# EAGLE design esp8266-dev-board (EAGLE 7.3.0)
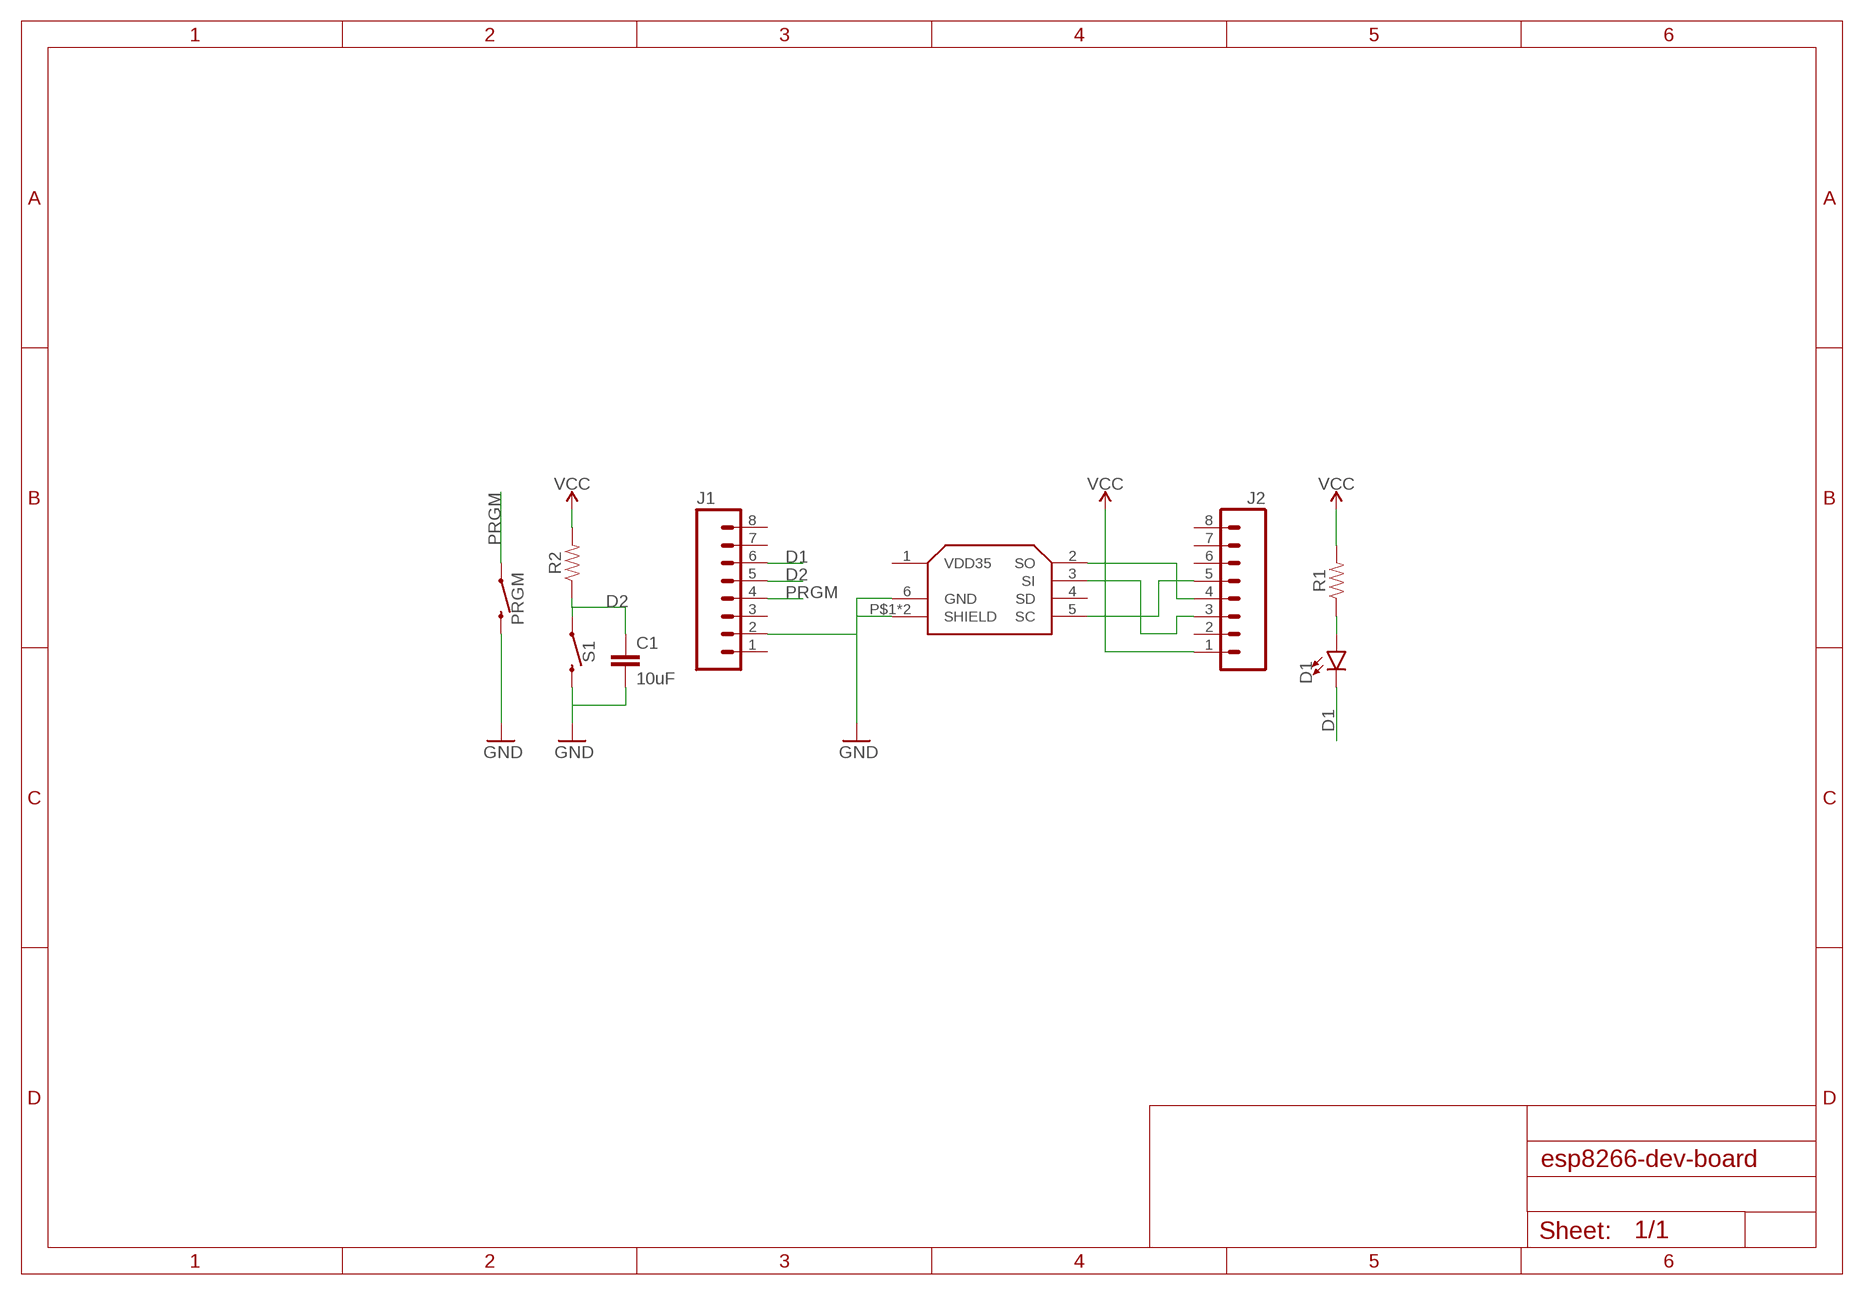
[diagram p0: schematic, sheet 1]

## Parts
C1  10uF  10UF-0805-10V-10%  [0805]
D1  LED0603  [LED-0603]
J1  M08  [1X08_ROUND]
J2  M08  [1X08_ROUND]
PRGM  MOMENTARY-SWITCH-SPST-SMD-6.0X3.5MM  [TACTILE_SWITCH_SMD_6.0X3.5MM]
R1  RESISTOR0805  [0805]
R2  RESISTOR0805  [0805]
S1  MOMENTARY-SWITCH-SPST-SMD-6.0X3.5MM  [TACTILE_SWITCH_SMD_6.0X3.5MM]
U$1  EXT-PORT-AGB  [EXT-PORT-AGB]

## Nets
D1: D1.C J1.6
D2: C1.1 J1.5 R2.1 S1.1
GND [GND]: C1.2 J1.2 PRGM.2 S1.2 U$1.6(GND) U$1.P$1(SHIELD) U$1.P$2(SHIELD)
N$1: J2.5 U$1.5(SC)
N$2: J2.4 U$1.2(SO)
N$3: J2.3 U$1.3(SI)
N$4: D1.A R1.1
PRGM: J1.4 PRGM.1
VCC: J2.1 R1.2 R2.2
Unconnected: J1.1 J1.3 J1.7 J1.8 J2.2 J2.6 J2.7 J2.8 U$1.1(VDD35) U$1.4(SD)

## Library data of the parts
C1 = SparkFun-Capacitors:10UF: 10.0µF ceramic capacitors A capacitor is a passive two-terminal electrical component used to store electrical energy temporarily in an electric field.; PROD_ID: CAP-11330
D1 = SparkFun-LED:LED: LED (Generic) Standard schematic elements and footprints for 5mm, 3mm, 1206, and 0603 sized LEDs. Generic LEDs with no color specified.
J1 J2 = SparkFun-Connectors:M08: Header 8 Standard 8-pin 0.1" header. Use with straight break away headers (SKU : PRT-00116), right angle break away headers (PRT-00553), swiss pins (PRT-00743), machine pins (PRT-00117), and female headers (PRT-00115).; PROD_ID: CONN-08437
PRGM S1 = SparkFun-Switches:MOMENTARY-SWITCH-SPST: Momentary Switch (Pushbutton) - SPST Normally-open (NO) SPST momentary switches (buttons, pushbuttons). Variants PTH-12MM - 12mm square, through-hole Momentary Pushbutton Switch - 12mm Square <https://www.sparkfun.com/products/9190> (COM-09190) PTH-6.0MM, PTH-6.0MM-KIT - 6.0mm square, through-hole Mini Pushbutton Switch <https://www.sparkfun.com/products/97> (COM-00097) KIT package intended for soldering kit's - only one side of pads' copper is exposed. PTH-RIGHT-ANGLE-KIT - Right-angle, through-hole Right Angle Tactile Button <https://www.sparkfun.com/products/10791> - Used on SparkFun BigTime Watch Kit <https://www.sparkfun.com/products/11734> SMD-12MM - 12mm square, surface-mount Tactile Button - SMD (12mm) <https://www.sparkfun.com/products/12993> (COM-12993) Used on SparkFun PicoBoard <https://www.sparkfun.com/products/11888> SMD-4.5MM - 4.5mm Square Trackball Switch Used on SparkFun Blackberry Trackballer Breakout <https://www.sparkfun.com/products/13169> SMD-4.6MMX2.8MM - 4.60mm x 2.80mm, surface mount Used on SparkFun SAMD21 Mini Breakout <https://www.sparkfun.com/products/13664> SMD-5.2MM, SMD-5.2-REDUNDANT - 5.2mm square, surface-mount Mini Pushbutton Switch - SMD <https://www.sparkfun.com/products/8720> (COM-08720) Used on Arduino Pro Mini <https://www.sparkfun.com/products/11114> REDUNDANT package connects both switch circuits together SMD-6.0X3.5MM - 6.0 x 3.5mm, surface mount Momentary Reset Switch SMD <https://www.sparkfun.com/products/8229> (COM-08229) SMD-6.2MM-TALL - 6.2mm square, surface mount Tactile Button - SMD (6mm) <https://www.sparkfun.com/products/12992> Used on SparkFun Digital Sandbox <https://www.sparkfun.com/products/12651> SMD-RIGHT-ANGLE - Right-angle, surface mount Used on SparkFun Block for Intel® Edison - Arduino <https://www.sparkfun.com/products/13036>; PROD_ID: SWCH-00815; SF_SKU: COM-08229
R1 R2 = SparkFun-Resistors:RESISTOR: Generic Resistor Package
U$1 = arcadetv:EXT-PORT-AGB

## Net classes
1 GND: clearance 0.254 mm

## Board
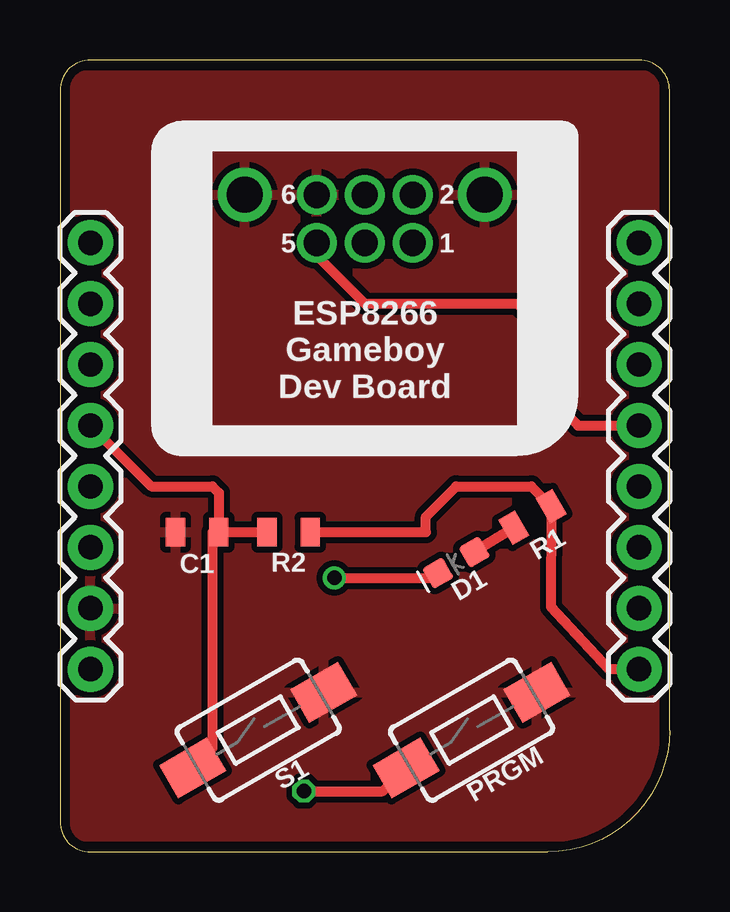
[diagram p1: board, top side]
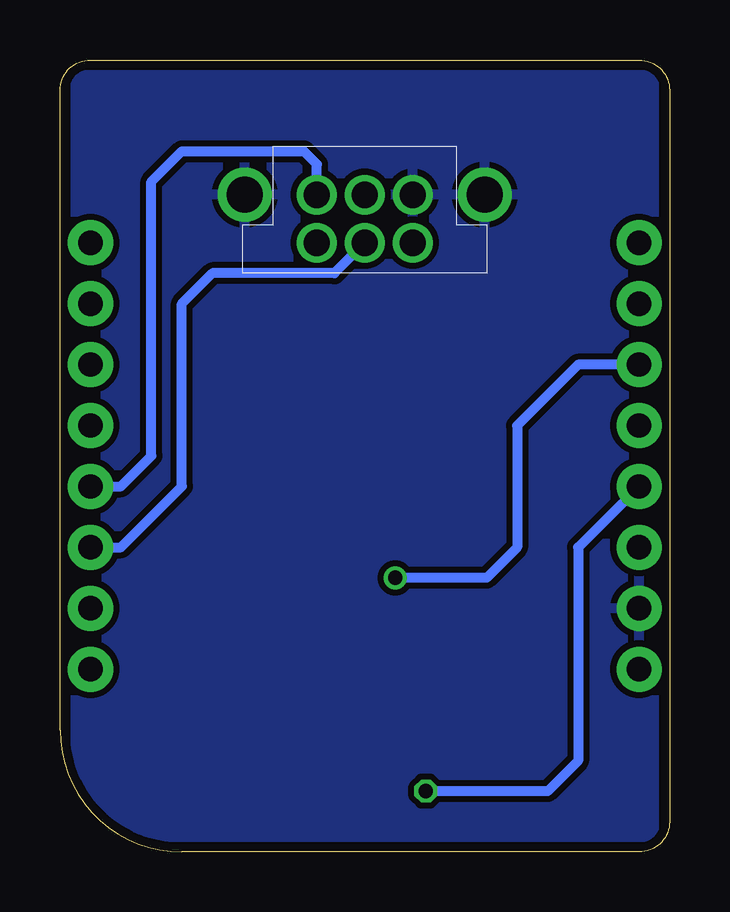
[diagram p2: board, bottom side, seen from below]

Size 25.4 x 33.02 mm. Coordinates in mm from the lower left corner, seen from the top.
Outline: 1.27,0 20.32,0 arc90 25.4,5.08 25.4,31.75 arc90 24.13,33.02 1.27,33.02 arc90 0,31.75 0,1.27 arc90 1.27,0
Copper layers (1*16): Top 0.0356mm / dielectric 1.5011mm / Bottom 0.0356mm
Design rules "oshpark-2layer": minimum track width 6mil, minimum drill 13mil, track to track 6mil, track to pad 6mil, pad to pad 6mil, via to via 6mil, smd to smd 6mil, copper to edge 15mil, drill to drill 6mil, minimum pad ring 7mil, minimum via ring 7mil, stop-mask expansion 2.5mil, vias tented up to drill 0mil, thermal gap 10mil

### Footprints (pad centres in the part's own frame; a part is rotated, then mirrored left to right if it is on the bottom)
0805 = smd 0.8 x 1.2: 1 -0.9,0; 2 0.9,0
LED-0603 = smd 1 x 1: A -0.877,0; C 0.877,0
1X08_ROUND = drill 1.016 pad 1.88: 1 0,0; 2 2.54,0; 3 5.08,0; 4 7.62,0; 5 10.16,0; 6 12.7,0; 7 15.24,0; 8 17.78,0
TACTILE_SWITCH_SMD_6.0X3.5MM = smd 2.3 x 1.6: 1 -3.15,0; 2 3.15,0
EXT-PORT-AGB = drill 1.1: 1 -2,0; 2 -2,2; 3 0,0; 4 0,2; 5 2,0; 6 2,2 | drill 1.5: P$1 -5,2; P$2 5,2

### Placement (x,y rotation side)
C1  5.71,13.33 180 top
D1  16.51,12.06 210 top
J1  1.27,7.62 90 top
J2  24.13,7.62 90 top
PRGM  17.14,5.08 30 top
R1  19.68,13.97 30 top
R2  9.53,13.33 0 top
S1  8.26,5.08 30 top
U$1  12.7,25.4 0 bottom

### Tracks (layer width: path | path; a pad name or v marks a point on that pad's centre or on a via)
D1  (via drill 0.6)
  Top 0.406: v11.43,11.43 15.55,11.43 D1.C
  Bottom 0.406: J1.6 3.81,20.32 6.35,17.78 6.35,12.7 7.62,11.43 v11.43,11.43
D2
  Top 0.406: 5.35,3.69 S1.1 6.35,4.33 6.35,13.33 C1.1 | J1.5 3.81,15.24 6.35,15.24 6.62,14.97 C1.1 | C1.1 R2.1
GND
  pour Bottom: 0.64,32.38 24.77,32.38 24.77,0.64 0.64,0.64
  pour Top: 0.64,32.38 24.77,32.38 24.77,0.64 0.64,0.64
N$1
  Top 0.406: U$1.5 10.7,24.86 12.7,22.86 19.05,22.86 20.32,21.59 20.32,19.05 21.59,17.78 J2.5
N$2
  Bottom 0.406: J2.4 22.86,15.24 21.59,16.51 21.59,27.94 20.32,29.21 15.24,29.21 14.7,28.67 U$1.2
N$3
  Bottom 0.406: U$1.3 13.97,24.13 19.05,24.13 20.32,22.86 20.32,15.24 22.86,12.7 J2.3
N$4
  Top 0.406: R1.1 D1.A
PRGM  (via drill 0.6)
  Top 0.406: v10.16,2.54 13.45,2.54 PRGM.1
  Bottom 0.406: J1.4 3.81,12.7 3.81,3.81 5.08,2.54 v10.16,2.54
VCC
  Top 0.406: J2.1 22.86,7.62 20.46,10.22 R1.2 19.64,15.24 16.51,15.24 15.24,13.97 15.24,13.33 R2.2

### Text on the board
tPlace: ESP8266 / Gameboy / Dev Board